# Altium schematic sheet DCMotor1CTRL.SchDoc: DC Motor Driver
size B; Date: 2015-01-23; Author: Marcin Czajkowski; Organization: Marcin Czajkowski; Address1: SN: 3547684; Address2: ESE-Year2; Address3: Conestoga Project; Address4: Project IV; DocumentNumber: 7; Revision: A; SheetNumber: 7; SheetTotal: 14
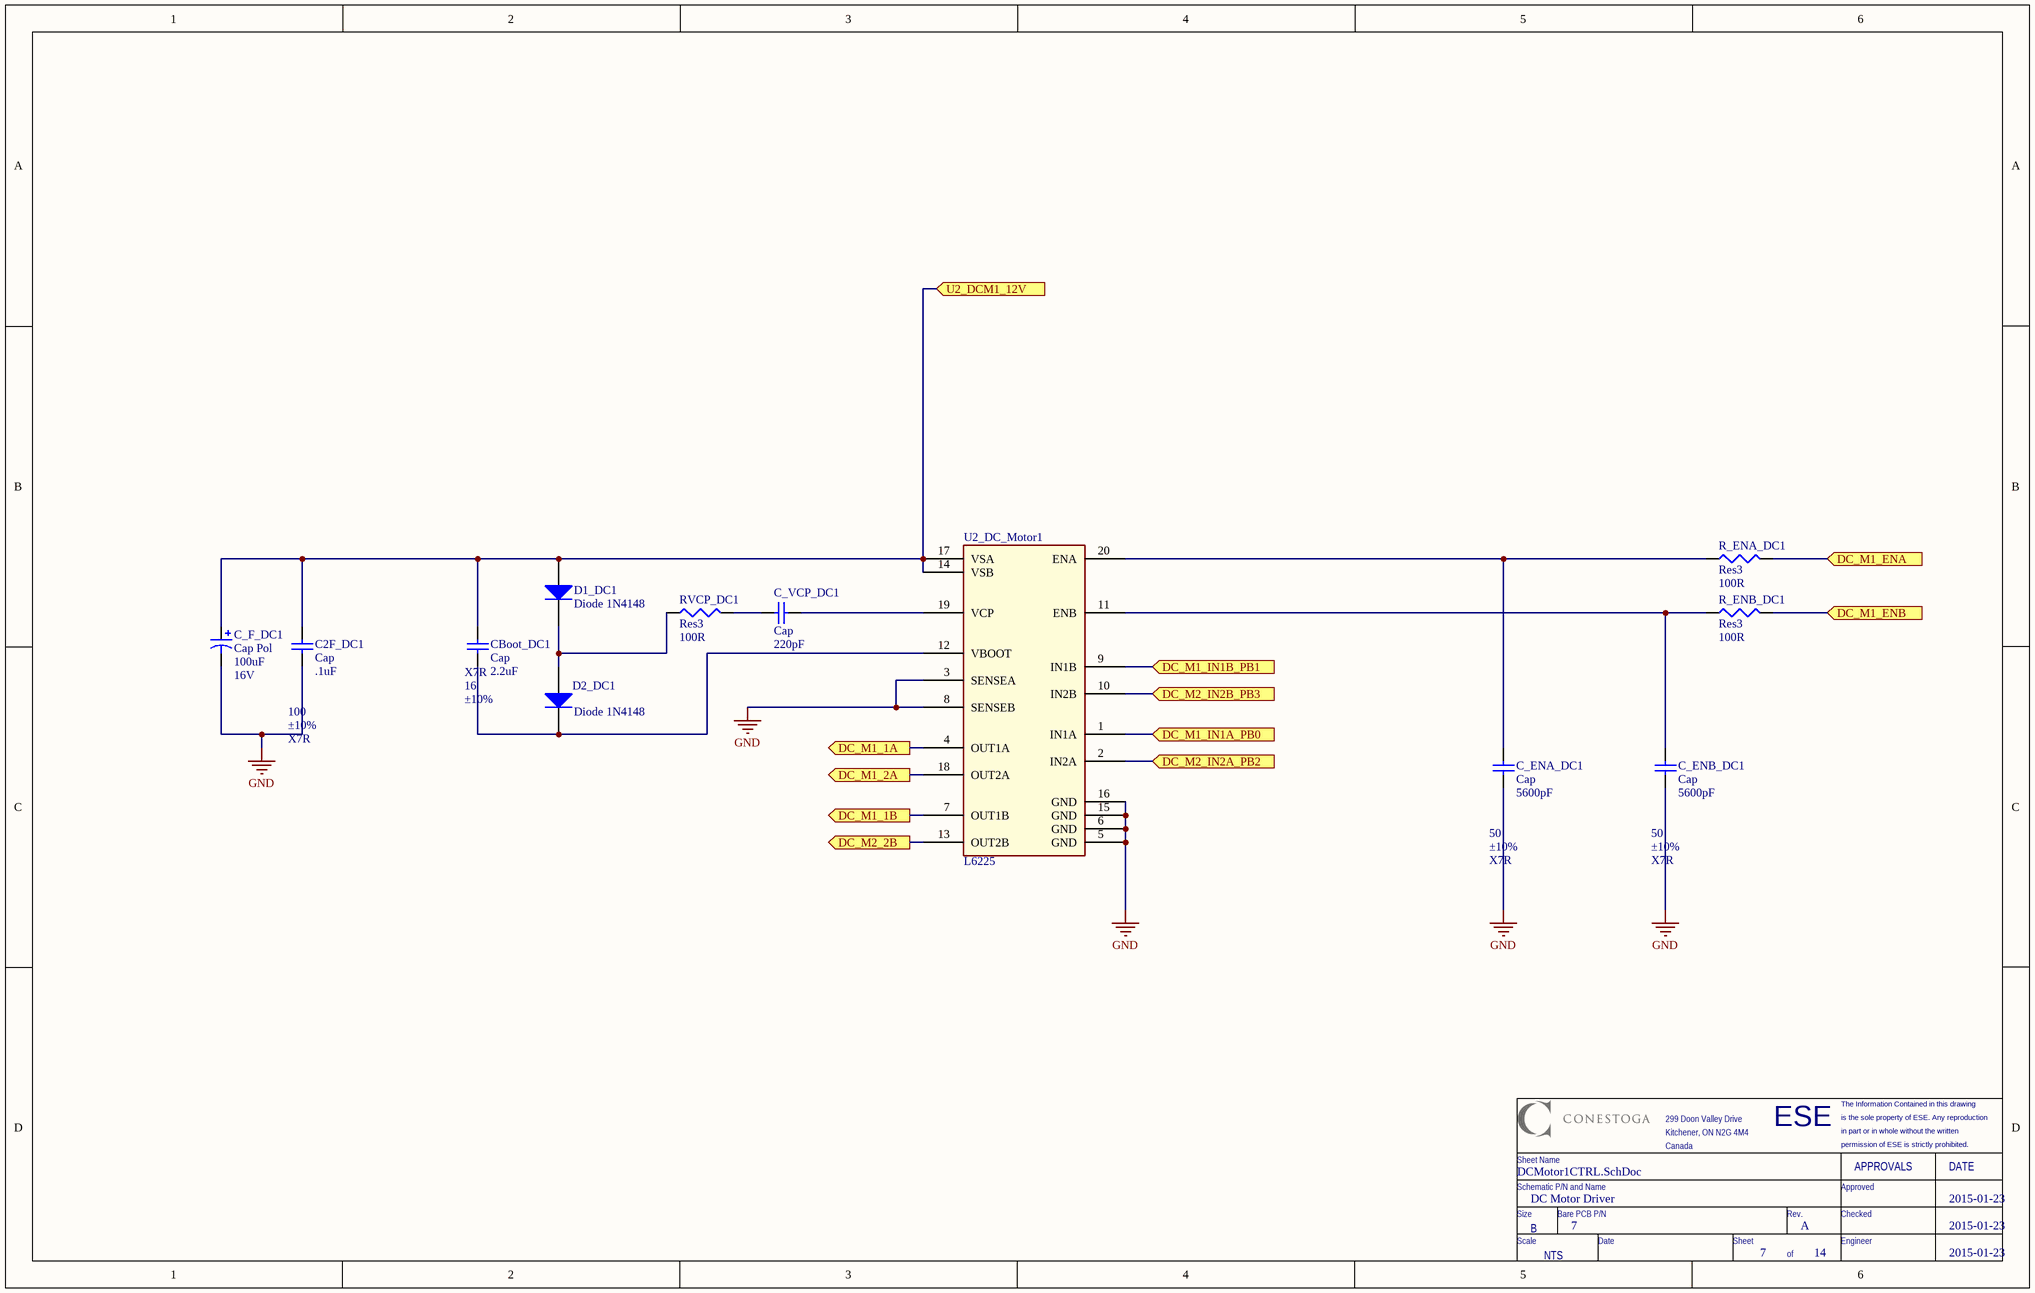
[diagram p0: DCMotor1CTRL.SchDoc]

## Parts
C2F_DC1  Cap  value .1uF  WV: 100  Tolerance: ±10%  Type: X7R  [CAPC2012X09M]
C_ENA_DC1  Cap  value 5600pF  WV: 50  Tolerance: ±10%  Type: X7R  [CAPC2012X09M]
C_ENB_DC1  Cap  value 5600pF  WV: 50  Tolerance: ±10%  Type: X7R  [CAPC2012X09M]
C_F_DC1  Cap Pol  value 100uF  Voltage: 16V  [CAPACITOR_6.3MM]
C_VCP_DC1  Cap  value 220pF  [CAPC2012X09M]
CBoot_DC1  Cap  value 2.2uF  WV: 16  Tolerance: ±10%  Type: X7R  [CAPC2012X09M]
D1_DC1  Diode 1N4148  [zener_sod323]
D2_DC1  Diode 1N4148  [zener_sod323]
R_ENA_DC1  Res3  value 100R  [RESC2112X05M]
R_ENB_DC1  Res3  value 100R  [RESC2112X05M]
RVCP_DC1  Res3  value 100R  [RESC2112X05M]
U2_DC_Motor1  L6225  [POWERSOP20]

## Ports
DC_M1_1A (out), DC_M1_1B (out), DC_M1_2A (out), DC_M1_ENA (in), DC_M1_ENB (in), DC_M1_IN1A_PB0 (in), DC_M1_IN1B_PB1 (in), DC_M2_2B (out), DC_M2_IN2A_PB2 (in), DC_M2_IN2B_PB3 (in), U2_DCM1_12V (in)

## Nets
GND: C2F_DC1.1 C_ENA_DC1.1 C_ENB_DC1.1 C_F_DC1.2 U2_DC_Motor1.3(SENSEA) U2_DC_Motor1.5(GND) U2_DC_Motor1.6(GND) U2_DC_Motor1.8(SENSEB) U2_DC_Motor1.15(GND) U2_DC_Motor1.16(GND)
DC_M1_1A: U2_DC_Motor1.4(OUT1A) ; port DC_M1_1A
DC_M1_1B: U2_DC_Motor1.7(OUT1B) ; port DC_M1_1B
DC_M1_2A: U2_DC_Motor1.18(OUT2A) ; port DC_M1_2A
DC_M1_ENA: R_ENA_DC1.2 ; port DC_M1_ENA
DC_M1_ENB: R_ENB_DC1.2 ; port DC_M1_ENB
DC_M1_IN1A_PB0: U2_DC_Motor1.1(IN1A) ; port DC_M1_IN1A_PB0
DC_M1_IN1B_PB1: U2_DC_Motor1.9(IN1B) ; port DC_M1_IN1B_PB1
DC_M2_2B: U2_DC_Motor1.13(OUT2B) ; port DC_M2_2B
DC_M2_IN2A_PB2: U2_DC_Motor1.2(IN2A) ; port DC_M2_IN2A_PB2
DC_M2_IN2B_PB3: U2_DC_Motor1.10(IN2B) ; port DC_M2_IN2B_PB3
U2_DCM1_12V: C2F_DC1.2 C_F_DC1.1 CBoot_DC1.2 D1_DC1.A U2_DC_Motor1.14(VSB) U2_DC_Motor1.17(VSA) ; port U2_DCM1_12V
NetC_ENA_DC1_2: C_ENA_DC1.2 R_ENA_DC1.1 U2_DC_Motor1.20(ENA)
NetC_ENB_DC1_2: C_ENB_DC1.2 R_ENB_DC1.1 U2_DC_Motor1.11(ENB)
NetC_VCP_DC1_1: C_VCP_DC1.1 RVCP_DC1.2
NetC_VCP_DC1_2: C_VCP_DC1.2 U2_DC_Motor1.19(VCP)
NetCBoot_DC1_1: CBoot_DC1.1 D2_DC1.K U2_DC_Motor1.12(VBOOT)
NetD1_DC1_K: D1_DC1.K D2_DC1.A RVCP_DC1.1

## Notes on the sheet
- ESE
- is the sole property of ESE. Any reproduction
- The Information Contained in this drawing
- Schematic P/N and Name
- Sheet Name
- 299 Doon Valley Drive
- Kitchener, ON N2G 4M4
- Canada
- Approved
- in part or in whole without the written
- permission of ESE is strictly prohibited.
- APPROVALS
- DATE
- Size
- Scale
- B
- NTS
- Bare PCB P/N
- Date
- Sheet
- Rev.
- Checked
- Engineer
- of

## Library data of the parts
C2F_DC1 = CAP-X7R-.1uF-100V-±10%: CAP CER .1uF 100v X7R 0805; MPN: C0805C104K1RACTU; PN: 399-3486-1-ND; Name: CAP-X7R-.1uF-100V-±10%; URL: http://www.digikey.ca/product-detail/en/C0805C104K1RACTU/399-3486-1-ND
C_ENA_DC1 C_ENB_DC1 = CAP-X7R-5600pF-50V-±10%: CAP CER 5600pF 50v X7R 0805; MPN: C0805C562K5RACTU; PN: 399-1156-1-ND; Name: CAP-X7R-5600pF-50V-±10%; URL: http://www.digikey.ca/product-detail/en/C0805C562K5RACTU/399-1156-1-ND
C_F_DC1 = Cap Polar-100uF-16V: CAP 85C 100uF ±20% 16V WX Series Aluminum Electrolytic; MPN: UWX1C101MCL1GB; Tan Theta: 0.16; Leakage Current: 16; Rated Ripple Current: 86; PN: 493-2105-1-ND; Name: Cap Polar-100uF-16V; Diameter: 6.3; URL: http://www.digikey.ca/product-detail/en/UWX1C101MCL1GB/493-2105-1-ND
C_VCP_DC1 = CAP-COG-220pF-50V-±5%: CAP CER 220pF 50v COG 0805; MPN: C0805C221J5GACTU; PN: 399-1127-1-ND; Name: CAP-COG-220pF-50V-±5%; URL: http://www.digikey.ca/product-detail/en/C0805C221J5GACTU/399-1127-1-ND
CBoot_DC1 = CAP-X7R-2.2uF-16V-±10%: CAP CER 2.2uF 16v X7R 0805; MPN: C0805C225K4RACTU; PN: 399-3523-1-ND; Name: CAP-X7R-2.2uF-16V-±10%; URL: http://www.digikey.ca/product-detail/en/C0805C225K4RACTU/399-3523-1-ND
D1_DC1 D2_DC1 = Diode 1N4148: High Conductance Fast Diode; PN: 1N4148WXTPMSCT-ND; URL: http://www.digikey.ca/product-detail/en/1N4148WX-TP/1N4148WXTPMSCT-ND/717312
R_ENA_DC1 R_ENB_DC1 RVCP_DC1 = Resistor_100R: RES SMD 100R OHM 1% 1/8W 0805; MPN: CRCW0805100RFKEA; PN: 541-100CCT-ND; Name: Resistor_100R; URL: http://www.digikey.ca/product-detail/en/CRCW0805100RFKEA/541-100CCT-ND
U2_DC_Motor1 = L6225: IC MOTOR DRIVER PAR 20POWERSO; MPN: L6225PDTR; PN: 497-5345-1-ND; URL: http://www.digikey.ca/product-detail/en/L6225PDTR/497-5345-1-ND